# EAGLE design pwm_nmos_555 (EAGLE 6.4)
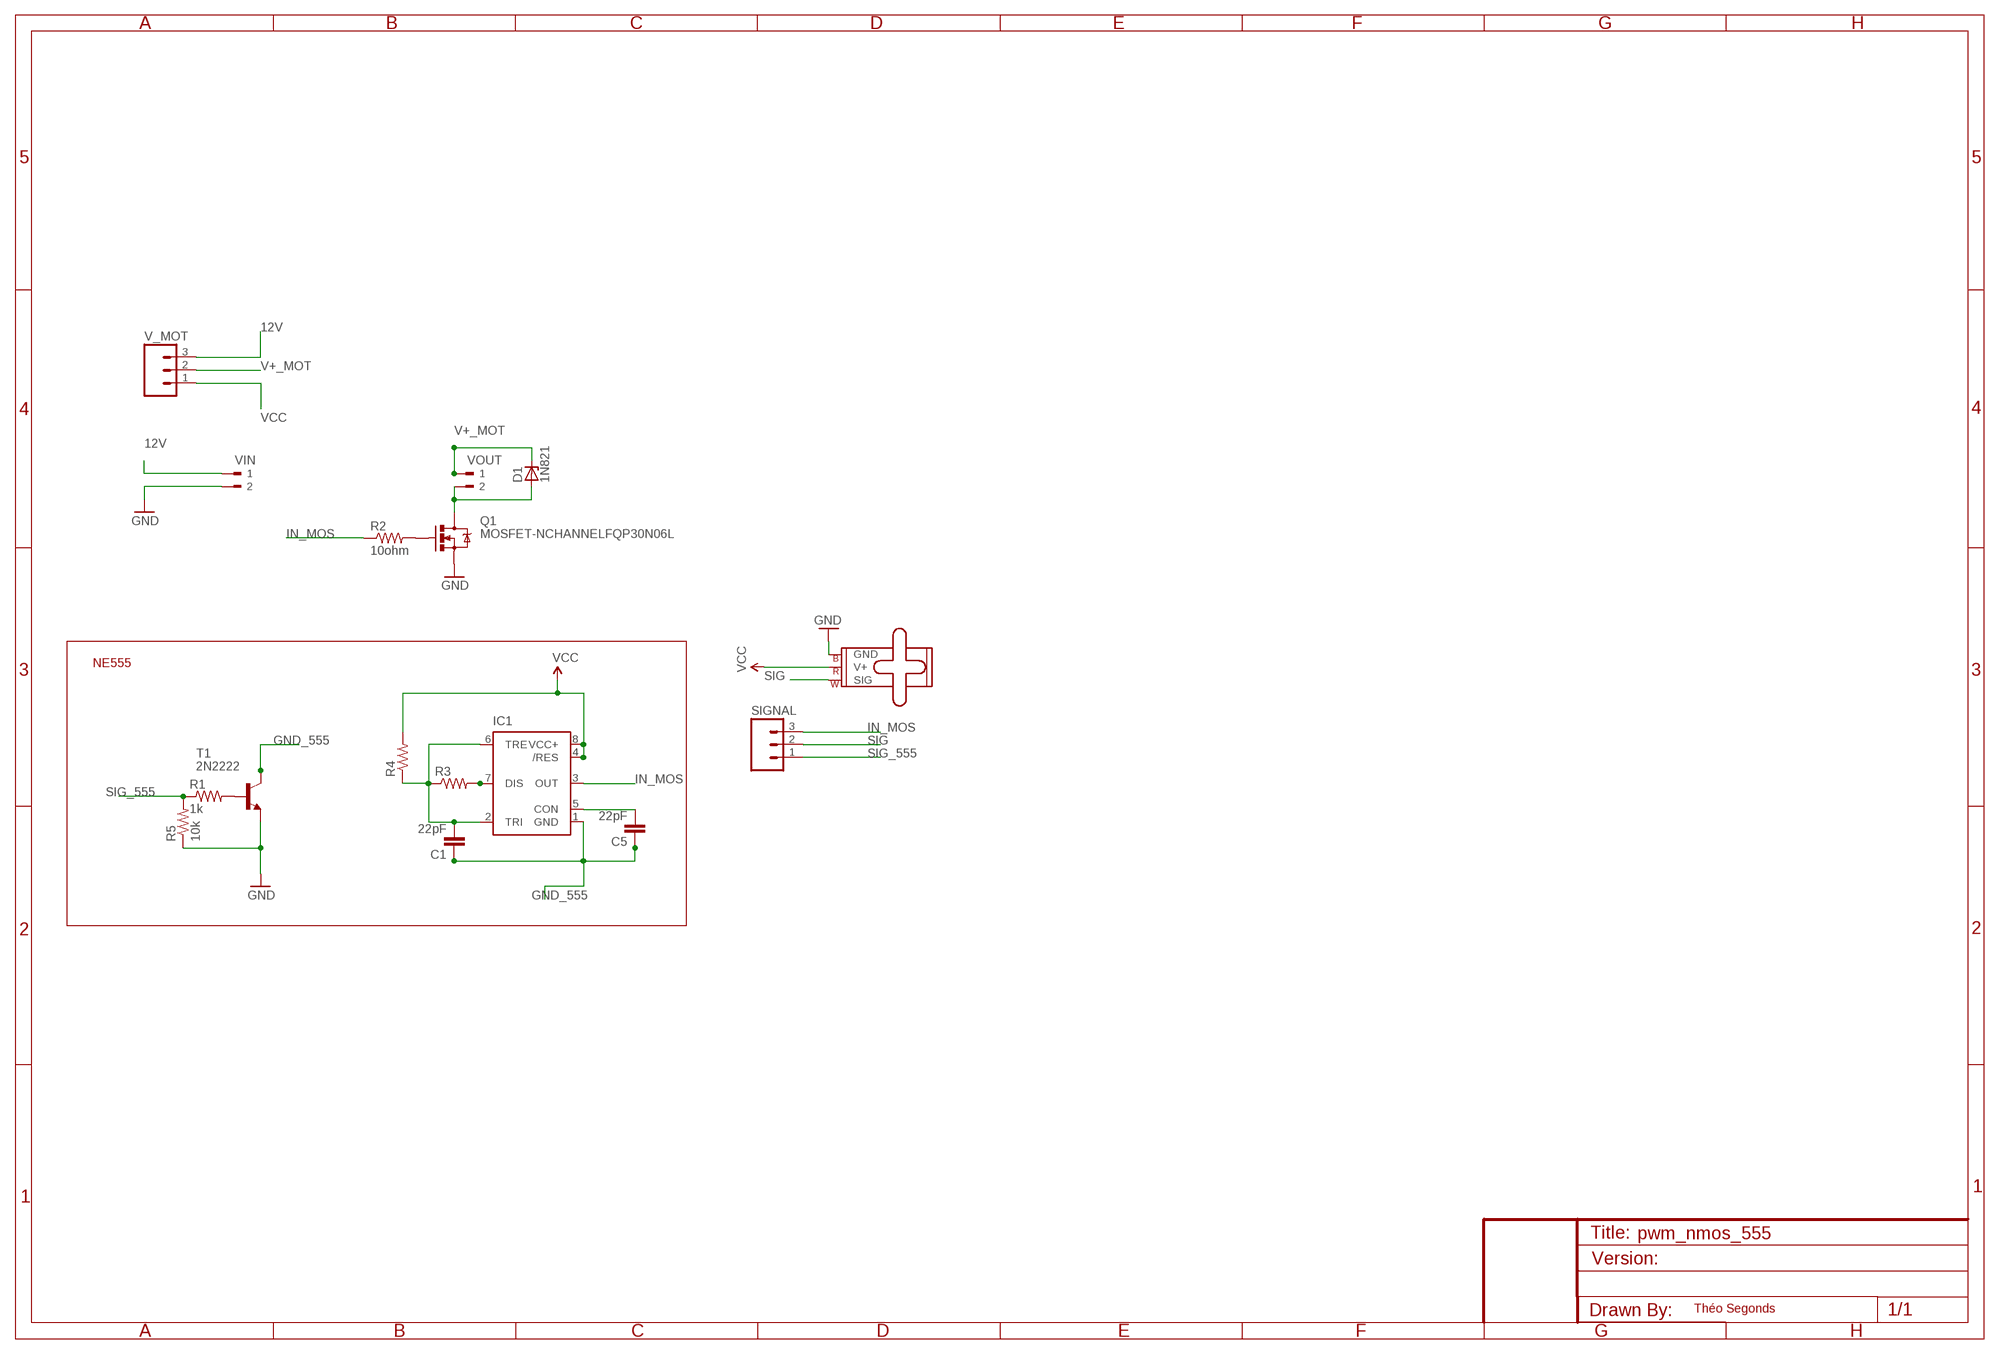
[diagram p0: schematic, sheet 1]

## Parts
C1  22pF  CAP0805  [0805]
C5  22pF  CAP0805  [0805]
D1  1N821  [DO35Z10]
IC1  NE555P  [DIL-08]
INPUT  SMALL_SERVO  [1X03]
Q1  MOSFET-NCHANNELFQP30N06L  [TO220V]
R1  1k  RESISTOR0805-RES  [0805]
R2  10ohm  RESISTOR0805-RES  [0805]
R3  RESISTOR0805-RES  [0805]
R4  RESISTOR0805-RES  [0805]
R5  10k  RESISTOR0805-RES  [0805]
SIGNAL  M03PTH  [1X03]
T1  2N2222  [TO92-EBC-OVAL]
V_MOT  M03PTH  [1X03]
VIN  90-2  [90-2]
VOUT  90-2  [90-2]

## Nets
12V: V_MOT.3 VIN.1
GND: INPUT.3(GND) Q1.3(S) R5.1 T1.E VIN.2
GND_555: C1.1 C5.1 IC1.1(GND) T1.C
IN_MOS: IC1.3(OUT) R2.1 SIGNAL.3
N$2: R1.2 T1.B
N$3: Q1.1(G) R2.2
N$5: C1.2 IC1.2(TRI) IC1.6(TRE) R3.1 R4.1
N$6: IC1.7(DIS) R3.2
N$8: C5.2 IC1.5(CON)
SIG: INPUT.1(SIG) SIGNAL.2
SIG_555: R1.1 R5.2 SIGNAL.1
V+_MOT: D1.C V_MOT.2 VOUT.1
VCC: IC1.4(/RES) IC1.8(VCC+) INPUT.2(V+) R4.2 V_MOT.1
VOUT: D1.A Q1.2(D) VOUT.2

## Notes on the sheet
- NE555
- Théo Segonds

## Library data of the parts
C1 C5 = SparkFun-Capacitors:CAP: Capacitor Standard 0603 ceramic capacitor, and 0.1" leaded capacitor.; MF: AVX; MPN: 08055A220JAT2A; OC_FARNELL: 2280675RL
D1 = diode:1N821: Reference DIODE temperature compensated, 6,2 V
IC1 = SparkFun-AnalogIC:NE555: General purpose bipolar Timer; MF: Arrow Electronics; MPN: NE555N; OC_FARNELL: 1467742; OC_NEWARK: 89K1486
INPUT = SparkFun-Electromechanical:SMALL_SERVO: Small servo motor This is the small servo used in the SIK. SKU: ROB-09065
Q1 = SparkFun-DiscreteSemi:MOSFET-NCHANNEL: Common NMOSFET Parts MFG P/N Store ID Prod ID FDD8780 TRANS-09984 SI7820DN TRANS-11055 FDS6630A IC-08089 2N7002PW TRANS-11151 FQP30N06L COM-10213 TRANS-10060 BSS123LT1G TRANS-08345 BSS138 TRANS-00830 BS170 2N7000; PROD_ID: TRANS-10060
R1-R5 = SparkFun-Resistors:RESISTOR: Resistor Basic schematic elements and footprints for 0603, 1206, and PTH resistors.
SIGNAL V_MOT = SparkFun-Connectors:M03: Header 3 Standard 3-pin 0.1" header. Use with straight break away headers (SKU : PRT-00116), right angle break away headers (PRT-00553), swiss pins (PRT-00743), machine pins (PRT-00117), and female headers (PRT-00115). Molex polarized connector foot print use with SKU : PRT-08232 with associated crimp pins and housings.
T1 = adafruit:2N2222: NPN TRANSISTOR Big oval pads
VIN VOUT = con-weidmueller-sl35:90-2: WEIDMUELLER CLAMP CONNECTOR; OC_FARNELL: unknown; OC_NEWARK: unknown

## Net classes
0 default: width 1.016 mm, drill 0.6 mm, clearance 0.3 mm

## Board
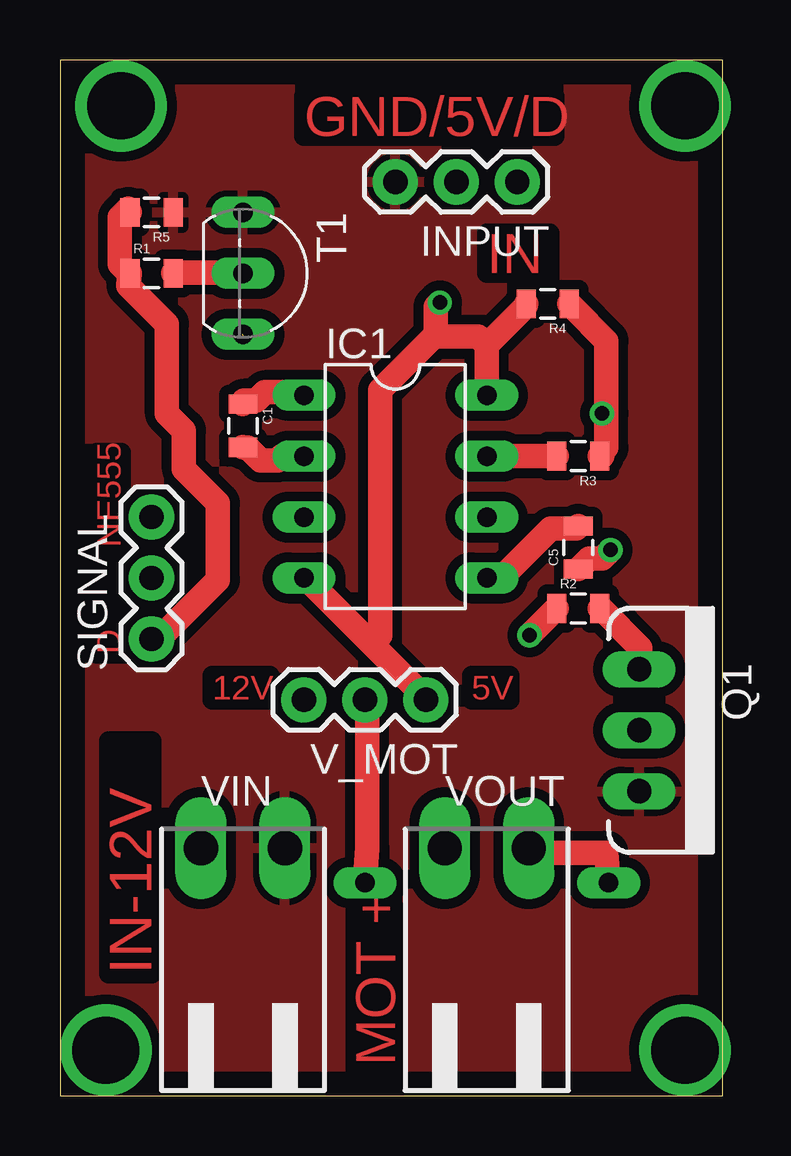
[diagram p1: board, top side]
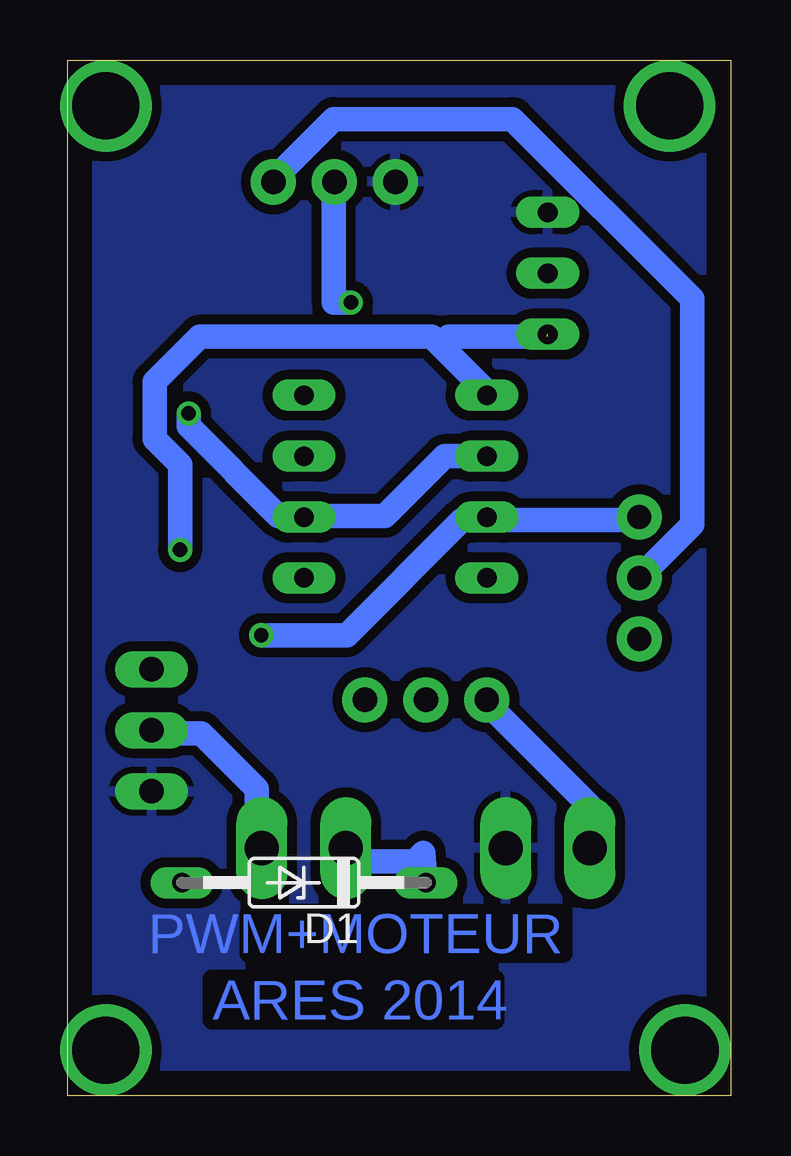
[diagram p2: board, bottom side, seen from below]

Size 27.61 x 43.17 mm. Coordinates in mm from the lower left corner, seen from the top.
Outline: 0,0 27.61,0 27.61,43.17 0,43.17 0,0
Copper layers (1*16): Top 0.1mm / dielectric 1.5mm / Bottom 0.1mm
Design rules "ensea *": minimum track width 0.4mm, minimum drill 0.6mm, track to track 0.3mm, track to pad 0.3mm, pad to pad 0.3mm, via to via 0.3mm, smd to smd 8mil, copper to edge 40mil, drill to drill 8mil, minimum pad ring 10mil, minimum via ring 8mil, stop-mask expansion 4mil, vias tented up to drill 0mil, thermal gap 10mil

### Footprints (pad centres in the part's own frame; a part is rotated, then mirrored left to right if it is on the bottom)
0805 = smd 0.8 x 1.2: 1 -0.9,0; 2 0.9,0
DO35Z10 = drill 0.813 long: A 5.08,0; C -5.08,0
DIL-08 = drill 0.813 long: 1 -3.81,-3.81; 2 -1.27,-3.81; 3 1.27,-3.81; 4 3.81,-3.81; 5 3.81,3.81; 6 1.27,3.81; 7 -1.27,3.81; 8 -3.81,3.81
1X03 = drill 1.016 pad 1.88: 1 0,0; 2 2.54,0; 3 5.08,0
TO220V = drill 1.016 long: 1 -2.54,0; 2 0,0; 3 2.54,0
TO92-EBC-OVAL = drill 0.813 long: B 0,-1.27; C 2.54,-1.27; E -2.54,-1.27
90-2 = drill 1.422 long: 1 -1.75,5.25; 2 1.75,5.25

### Placement (x,y rotation side)
C1  7.62,27.94 270 top
C5  21.59,22.86 90 top
D1  17.78,8.89 180 bottom
IC1  13.97,25.4 270 top
INPUT  19.05,38.1 180 top
Q1  24.13,15.24 270 top
R1  3.81,34.29 0 top
R2  21.59,20.32 0 top
R3  21.59,26.67 180 top
R4  20.32,33.02 180 top
R5  3.81,36.83 180 top
SIGNAL  3.81,19.05 90 top
T1  8.89,34.29 270 top
V_MOT  15.24,16.51 180 top
VIN  7.62,5.08 0 top
VOUT  17.78,5.08 0 top

### Tracks (layer width: path | path; a pad name or v marks a point on that pad's centre or on a via)
12V
  Bottom 1.016: V_MOT.3 10.13,16.36 5.87,12.09 5.87,10.49 VIN.1
GND
  pour Top (isolate 0.406): -1.27,54.61 -1.27,-1.27 41.91,-1.27 41.91,55.88 -1.27,55.88
  pour Bottom (isolate 0.406): -3.17,52.7 -3.17,-0.64 40.64,0 40.64,53.34 0,53.34
GND_555  (via drill 0.6)  (1 unrouted)
  Top 1.016: v22.94,22.76 22.58,22.4 22.05,22.4 21.69,22.05 C5.1 | C1.1 7.64,28.98 8.18,28.98 8.53,29.34 10.13,29.34 IC1.1
  Bottom 1.016: v22.94,22.76 22.94,26.31 24,27.38 24,29.77 22.13,31.65 12.45,31.65 12.09,31.29 | 12.09,31.29 10.13,29.34 IC1.1 | 7.64,31.65 11.73,31.65 12.09,31.29
IN_MOS  (via drill 0.6)
  Top 1.016: v19.56,19.2 20.62,20.27 R2.1
  Bottom 1.016: v19.56,19.2 16,19.2 11.2,24 10.31,24 IC1.3 9.78,24 3.91,24 SIGNAL.3
N$1  (via drill 2.8)
  other vias: 26.04,41.27
N$2
  Top 1.016: R1.2 4.8,34.31 7.47,34.31 T1.B
N$3
  Top 1.016: R2.2 22.58,20.27 24.18,18.67 24.18,17.78 Q1.1
N$4  (via drill 2.8)
  other vias: 26.04,1.91
N$5  (via drill 0.6)
  Top 1.016: 22.76,28.45 22.76,27.03 22.58,26.85 22.58,26.67 R3.1 | 22.76,28.45 22.76,31.47 21.34,32.89 R4.1 | IC1.2 9.25,26.67 9.07,26.49 8.36,26.49 7.82,27.03 7.64,27.03 C1.2 | v22.58,28.45 22.76,28.45
  Bottom 1.016: IC1.2 11.91,26.67 14.4,24.18 17.78,24.18 IC1.6 18.14,24.18 18.85,24.18 22.58,27.91 v22.58,28.45
N$6
  Top 1.016: IC1.7 R3.2
N$7  (via drill 2.8)
  other vias: 2.54,41.27
N$8
  Top 1.016: C5.2 21.51,23.65 20.45,23.65 18.49,21.69 17.78,21.69 IC1.5
N$9  (via drill 2.8)
  other vias: 1.91,1.91
SIG
  Bottom 1.016: SIGNAL.2 3.73,21.69 1.6,23.82 1.6,33.23 9.09,40.72 16.54,40.72 19.02,38.23 INPUT.1
SIG_555
  Top 1.016: R5.2 2.85,36.98 2.49,36.63 2.49,34.67 2.85,34.31 R1.1 2.85,33.78 4.45,32.18 4.45,28.45 5.16,27.74 5.16,26.14 6.58,24.71 6.58,21.51 4.27,19.2 3.91,19.2 SIGNAL.1
V+_MOT
  Top 1.016: V_MOT.2 12.8,16.36 12.8,10.31 D1.C
  Bottom 1.016: D1.C 12.8,10.13 13.16,9.78 15.47,9.78 16,10.31 VOUT.1
VCC  (via drill 0.6)
  Top 1.016: 17.78,31.29 19.38,32.89 R4.2 | IC1.8 17.78,31.29 | 12.98,18.85 15.11,16.71 15.11,16.54 V_MOT.1 | 12.98,18.85 10.31,21.51 IC1.4 | 15.65,31.65 15.57,31.65 13.34,29.41 13.34,19.2 12.98,18.85 | 15.65,31.65 17.42,31.65 17.78,31.29 | v15.82,33.07 15.65,32.89 15.65,31.65
  Bottom 1.016: v15.82,33.07 16.54,33.07 16.54,38.05 INPUT.2
VOUT
  Top 1.016: D1.A 22.76,10.13 19.56,10.13 19.56,10.31 VOUT.2
  Bottom 1.016: Q1.2 24,15.11 22.05,15.11 19.74,12.8 19.74,10.49 19.56,10.49 VOUT.2

### Text on the board
Top: GND/5V/D | IN | NE555 | D | 12V | 5V | IN-12V | MOT +
Bottom: PWM+MOTEUR | ARES 2014